# Altium schematic sheet 1_top.SchDoc
size A4
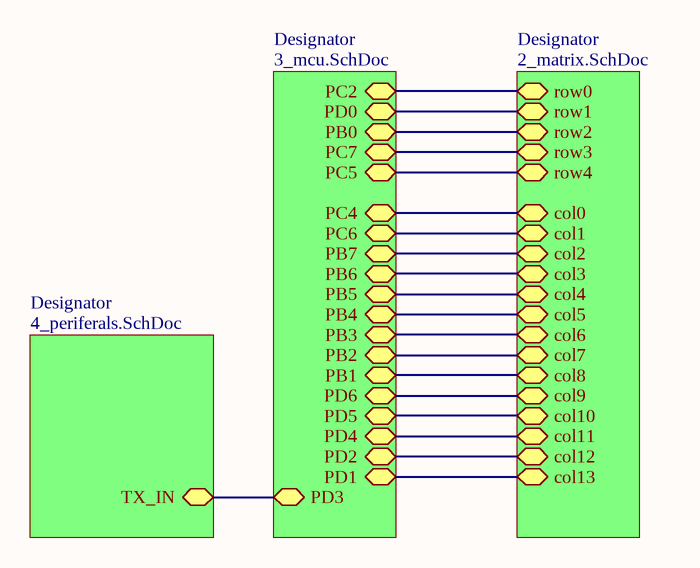
[diagram p0: 1_top.SchDoc]

## Sub-sheets
Designator = 2_matrix.SchDoc: col11, col13, col6, col8, col12, col5, col0, col10, col7, col3, col2, col1, col4, row0, col9, row3, row1, row4, row2
Designator = 3_mcu.SchDoc: PD5, PD4, PC7, PB5, PB6, PB4, PD1, PB0, PB7, PD2, PC6, PD0, PC5, PC4, PB3, PB2, PB1, PC2, PD6, PD3
Designator = 4_periferals.SchDoc: TX_IN

## Nets
(unnamed): sheet Designator/col11, sheet Designator/PD4
(unnamed): sheet Designator/col13, sheet Designator/PD1
(unnamed): sheet Designator/col6, sheet Designator/PB3
(unnamed): sheet Designator/col8, sheet Designator/PB1
(unnamed): sheet Designator/col12, sheet Designator/PD2
(unnamed): sheet Designator/col5, sheet Designator/PB4
(unnamed): sheet Designator/col0, sheet Designator/PC4
(unnamed): sheet Designator/col10, sheet Designator/PD5
(unnamed): sheet Designator/col7, sheet Designator/PB2
(unnamed): sheet Designator/col3, sheet Designator/PB6
(unnamed): sheet Designator/col2, sheet Designator/PB7
(unnamed): sheet Designator/col1, sheet Designator/PC6
(unnamed): sheet Designator/col4, sheet Designator/PB5
(unnamed): sheet Designator/row0, sheet Designator/PC2
(unnamed): sheet Designator/col9, sheet Designator/PD6
(unnamed): sheet Designator/row3, sheet Designator/PC7
(unnamed): sheet Designator/row1, sheet Designator/PD0
(unnamed): sheet Designator/row4, sheet Designator/PC5
(unnamed): sheet Designator/row2, sheet Designator/PB0
(unnamed): sheet Designator/PD3, sheet Designator/TX_IN